# EAGLE design LabPower-FB (EAGLE 7.6.0)
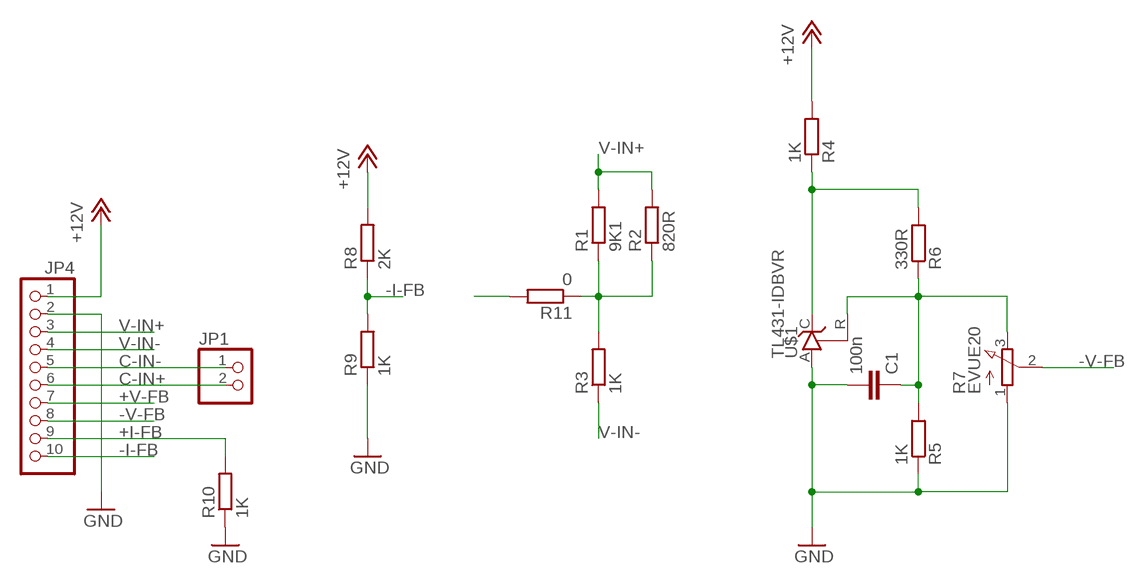
[diagram p0: schematic, sheet 1]

## Parts
C1  100n  C-EUC0805  [C0805]
JP1  PINHD-1X2/90  [1X02/90]
JP4  PINHD-1X10  [1X10]
R1  9K1  R-EU_R0805  [R0805]
R2  820R  R-EU_R0805  [R0805]
R3  1K  R-EU_R0805  [R0805]
R4  1K  R-EU_R0805  [R0805]
R5  1K  R-EU_R0805  [R0805]
R6  330R  R-EU_R0805  [R0805]
R7  EVUE20  [EVUE]
R8  2K  R-EU_R0805  [R0805]
R9  1K  R-EU_R0805  [R0805]
R10  1K  R-EU_R0805  [R0805]
R11  0  R-EU_R0805  [R0805]
U$1  TL431-IDBVR  [SOT23-5]

## Nets
+12V: JP4.1 R4.2 R8.2
+I-FB: JP4.9 R10.2
+V-FB: JP4.7 R11.2
-I-FB: JP4.10 R8.1 R9.2
-V-FB: JP4.8 R7.2(S)
C-IN+: JP1.2 JP4.6
C-IN-: JP1.1 JP4.5
GND: C1.2 JP4.2 R5.1 R7.1(A) R9.1 R10.1 U$1.A
N$1: R4.1 R6.2 U$1.C
N$2: C1.1 R5.2 R6.1 R7.3(E) U$1.R
N$3: R1.1 R2.1 R3.2 R11.1
V-IN+: JP4.3 R1.2 R2.2
V-IN-: JP4.4 R3.1

## Library data of the parts
C1 = rcl:C-EU: CAPACITOR, European symbol
JP1 = pinhead:PINHD-1X2: PIN HEADER
JP4 = pinhead:PINHD-1X10: PIN HEADER
R1-R6 R8-R11 = rcl:R-EU_: RESISTOR, European symbol
R7 = pot:EVU: 9 mm Square Rotary Potentiometers Source: Panasonic
U$1 = TL431:TL431-IDBVR

## Net classes
0 default: clearance 0.205 mm

## Board
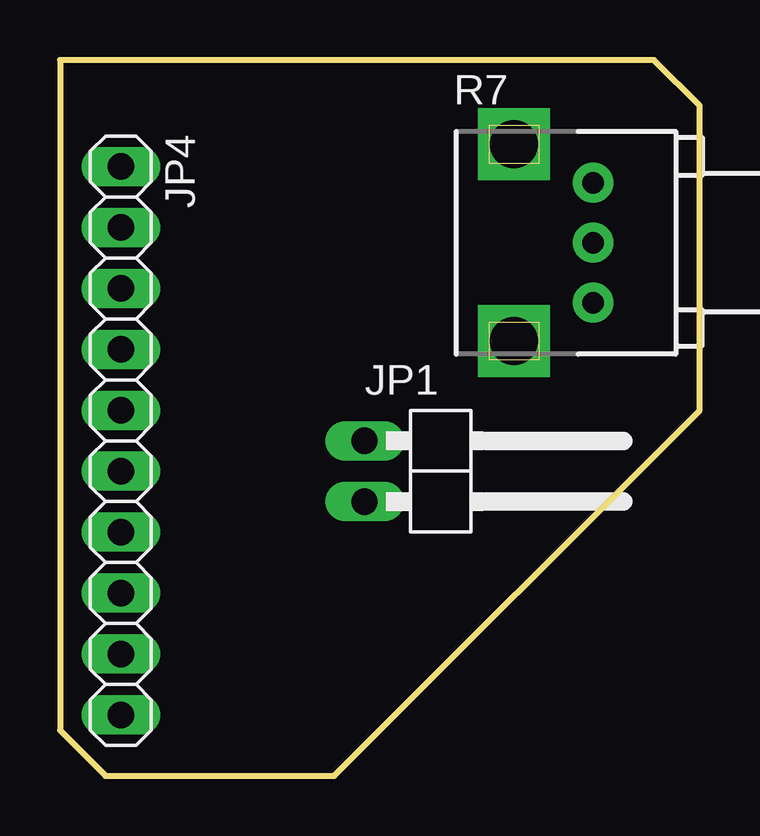
[diagram p1: board, top side]
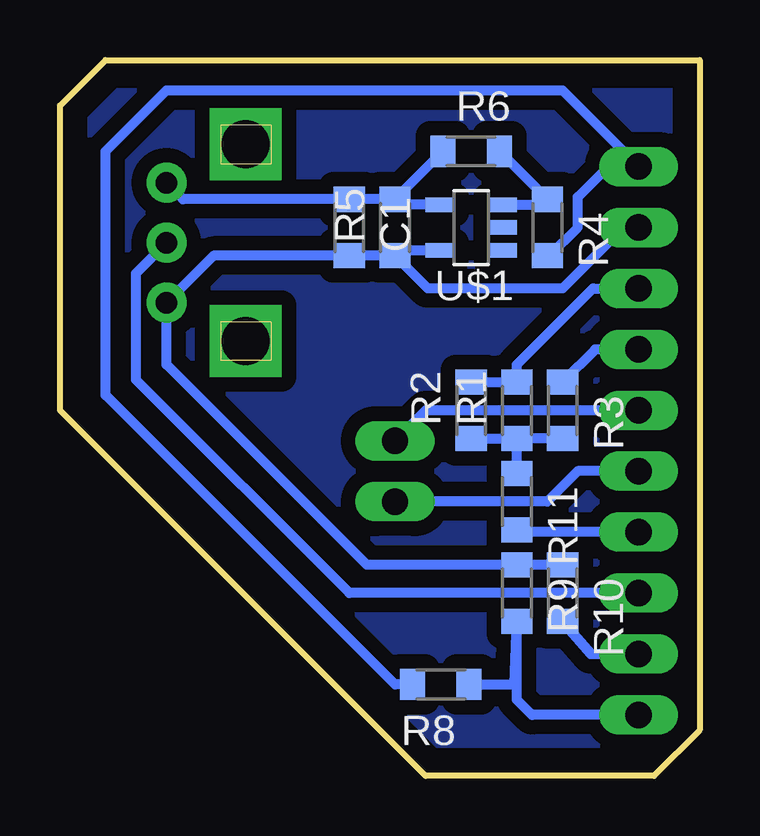
[diagram p2: board, bottom side, seen from below]

Size 26.67 x 29.85 mm. Coordinates in mm from the lower left corner, seen from the top.
Outline: 0,29.85 0,1.91 1.91,0 11.43,0 26.67,15.24 26.67,27.94 24.77,29.85 0,29.85
Copper layers (1*16): Top 0.035mm / dielectric 1.5mm / Bottom 0.035mm
Design rules "default *": minimum track width 10mil, minimum drill 24mil, track to track 8mil, track to pad 8mil, pad to pad 8mil, via to via 8mil, smd to smd 8mil, copper to edge 40mil, drill to drill 8mil, minimum pad ring 10mil, minimum via ring 8mil, stop-mask expansion 4mil, vias tented up to drill 0mil, thermal gap 10mil

### Footprints (pad centres in the part's own frame; a part is rotated, then mirrored left to right if it is on the bottom)
C0805 = smd 1.05 x 1.3: 1 -1.175,0; 2 1.175,0
1X02/90 = drill 1.1 pad 1.422 long: 1 -1.27,-3.81; 2 1.27,-3.81
1X10 = drill 1.1 long: 1 -11.43,0; 2 -8.89,0; 3 -6.35,0; 4 -3.81,0; 5 -1.27,0; 6 1.27,0; 7 3.81,0; 8 6.35,0; 9 8.89,0; 10 11.43,0
R0805 = smd 1.05 x 1.3: 1 -1.175,0; 2 1.175,0
EVUE = drill 0.9 pad 1.676: 1 0,-2.5; 2 0,0; 3 0,2.5 | drill 2 pad 2.8 square: M1 -3.3,4.1; M2 -3.3,-4.1
SOT23-5 = smd 0.6 x 1.2: + 0,-2.576; A -0.95,0.036; C 0.95,-2.576; NC -0.95,-2.576; R 0.95,0.036

### Placement (x,y rotation side)
C1  14.61,22.86 270 bottom
JP1  16.51,12.7 270 top
JP4  2.54,13.97 270 top
R1  7.62,15.24 90 bottom
R2  9.53,15.24 90 bottom
R3  5.71,15.24 270 bottom
R4  6.35,22.86 270 bottom
R5  12.7,22.86 90 bottom
R6  9.53,26.04 0 bottom
R7  22.23,22.23 0 top
R8  10.79,3.81 180 bottom
R9  7.62,7.62 270 bottom
R10  5.71,7.62 270 bottom
R11  7.62,11.43 270 bottom
U$1  10.79,22.86 90 bottom

### Tracks (layer width: path | path; a pad name or v marks a point on that pad's centre or on a via)
+12V
  Bottom 0.406: R4.2 6.25,21.69 5.08,22.86 5.08,24.13 3.81,25.4 JP4.1 5.71,28.58 22.23,28.58 24.77,26.04 24.77,15.88 12.7,3.81 R8.2
+I-FB
  Bottom 0.406: R10.2 4.54,5.08 JP4.9
+V-FB
  Bottom 0.406: JP4.7 7.52,10.16 R11.2
-I-FB
  Bottom 0.406: JP4.10 6.98,2.54 7.62,3.18 R9.2 7.71,3.81 R8.1
-V-FB
  Bottom 0.406: JP4.8 14.61,7.62 23.5,16.51 23.5,20.96 R7.2
C-IN+
  Bottom 0.406: JP4.6 5.08,12.7 6.35,11.43 JP1.2
C-IN-
  Bottom 0.406: JP4.5 11.43,15.24 JP1.1
GND
  Bottom 0.406: JP4.2 3.17,22.86 5.71,20.32 11.33,20.32 R5.1 | R5.1 12.47,21.91 U$1.A | R5.1 C1.2 20.27,21.69 R7.1 22.23,17.15 13.88,8.8 R10.1 R9.1
N$1
  Bottom 0.406: R6.2 R4.1 6.58,23.81 U$1.C
N$2
  Bottom 0.406: U$1.R 12.47,23.81 R5.2 | R6.1 R5.2 | R5.2 C1.1 21.54,24.04 R7.3
N$3
  Bottom 0.406: R11.1 R1.1 | R3.2 R1.1 | R2.1 R1.1
N$4
  pour Bottom (isolate 0.61): 0,1.91 0,29.85 24.77,29.85 26.67,27.94 26.67,15.24 11.43,0 1.91,0
V-IN+
  Bottom 0.406: JP4.3 4.45,20.32 7.62,17.15 R1.2 R2.2
V-IN-
  Bottom 0.406: JP4.4 4.35,17.78 R3.1